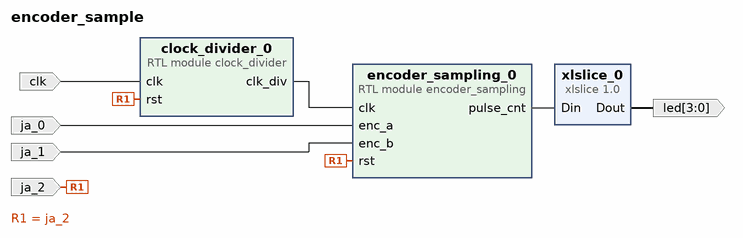
[diagram p0: block diagram of the top level]
# Vivado block design encoder_sample, xc7z020clg400-1, Vivado 2023.2
create_bd_design encoder_sample

create_bd_port -dir O -from 3 -to 0 led
create_bd_port -dir I -type clk clk
set_property -dict {CONFIG.FREQ_HZ 125000000} [get_bd_ports clk]
create_bd_port -dir I ja_0
create_bd_port -dir I ja_1
create_bd_port -dir I -type rst ja_2

create_bd_cell -type module -reference encoder_sampling encoder_sampling_0
create_bd_cell -type ip -vlnv xilinx.com:ip:xlslice:1.0 xlslice_0
set_property -dict {CONFIG.DIN_FROM 8 CONFIG.DIN_TO 5 CONFIG.DIN_WIDTH 9} [get_bd_cells xlslice_0]
create_bd_cell -type module -reference clock_divider clock_divider_0
set_property -dict {CONFIG.n_bits 7} [get_bd_cells clock_divider_0]

# ---- connections ----

connect_bd_net -net clk_0_1 [get_bd_ports clk] [get_bd_pins clock_divider_0/clk]
connect_bd_net [get_bd_pins clock_divider_0/clk_div] [get_bd_pins encoder_sampling_0/clk]
connect_bd_net -net enc_a_0_1 [get_bd_ports ja_0] [get_bd_pins encoder_sampling_0/enc_a]
connect_bd_net -net enc_b_0_1 [get_bd_ports ja_1] [get_bd_pins encoder_sampling_0/enc_b]
connect_bd_net [get_bd_pins encoder_sampling_0/pulse_cnt] [get_bd_pins xlslice_0/Din]
connect_bd_net -net rst_0_1 [get_bd_ports ja_2] [get_bd_pins encoder_sampling_0/rst] [get_bd_pins clock_divider_0/rst]
connect_bd_net [get_bd_pins xlslice_0/Dout] [get_bd_ports led]

validate_bd_design
save_bd_design
